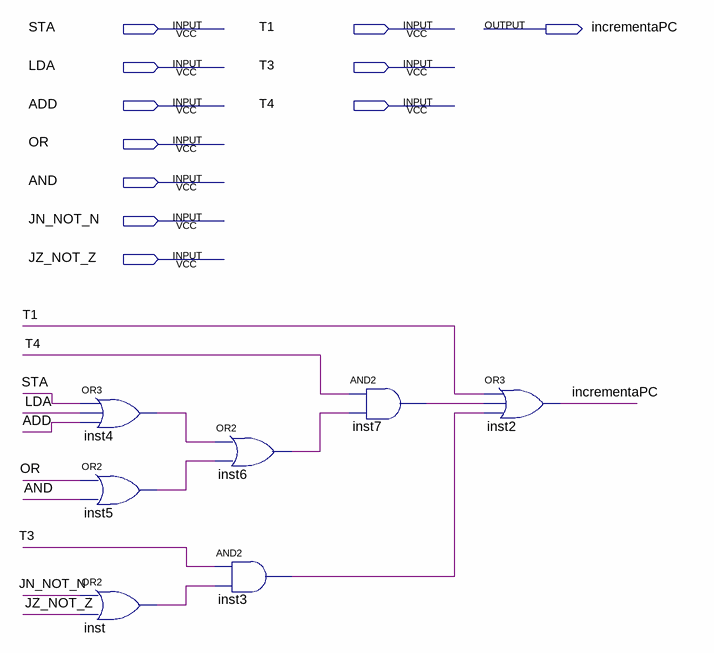
[diagram p0: schematic sheet]
// Quartus schematic incrementaPC.bdf as structural Verilog: 7 symbols, 11 pins
module incrementaPC (
  input  STA,
  input  T1,
  input  LDA,
  input  T3,
  input  ADD,
  input  T4,
  input  OR,
  input  AND,
  input  JN_NOT_N,
  input  JZ_NOT_Z,
  output incrementaPC
);

  wire inst3_out, inst4_out, inst5_out, inst6_out, inst7_out, inst_out;

  or inst4 (inst4_out, STA, LDA, ADD);
  or inst5 (inst5_out, OR, AND);
  or inst (inst_out, JN_NOT_N, JZ_NOT_Z);
  or inst6 (inst6_out, inst4_out, inst5_out);
  and inst3 (inst3_out, T3, inst_out);
  and inst7 (inst7_out, T4, inst6_out);
  or inst2 (incrementaPC, T1, inst7_out, inst3_out);
endmodule
